# EAGLE design USB-DDC (EAGLE 9.6.2)
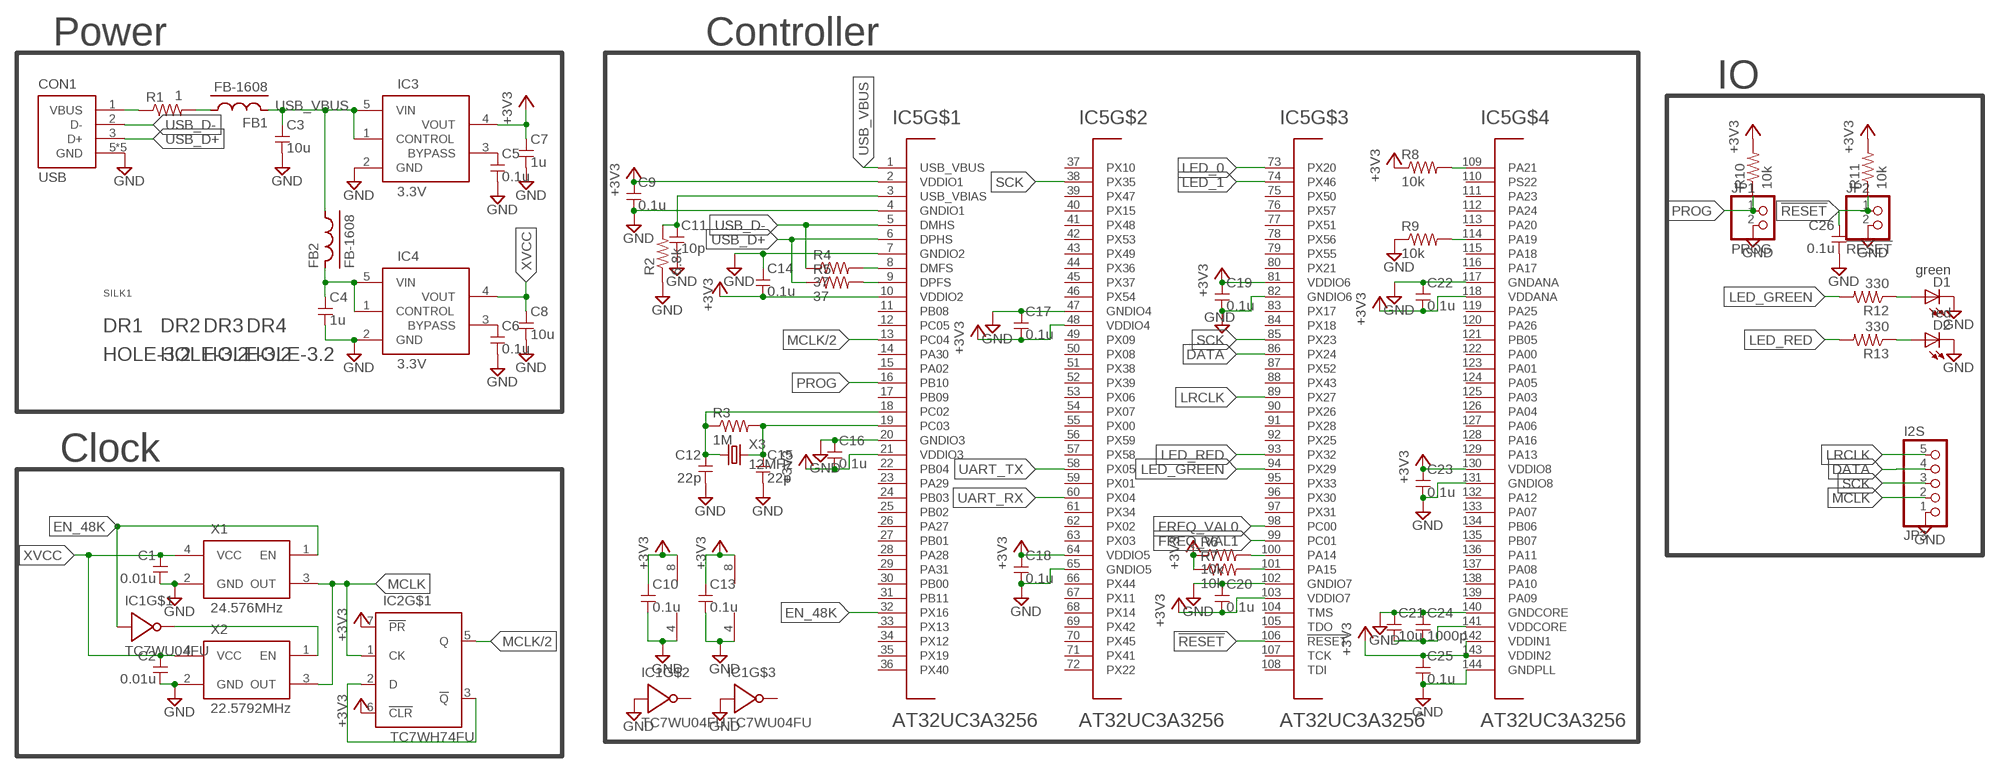
[diagram p0: schematic, sheet 1]

## Parts
C1  0.01u  C-1608  [1608]
C2  0.01u  C-1608  [1608]
C3  10u  C-2012  [2012]
C4  1u  C-1608  [1608]
C5  0.1u  C-1608  [1608]
C6  0.1u  C-1608  [1608]
C7  1u  C-2012  [2012]
C8  10u  C-2012  [2012]
C9  0.1u  C-1608  [1608]
C10  0.1u  C-1608  [1608]
C11  10p  C-1608  [1608]
C12  22p  C-1608  [1608]
C13  0.1u  C-1608  [1608]
C14  0.1u  C-1608  [1608]
C15  22p  C-1608  [1608]
C16  0.1u  C-1608  [1608]
C17  0.1u  C-1608  [1608]
C18  0.1u  C-1608  [1608]
C19  0.1u  C-1608  [1608]
C20  0.1u  C-1608  [1608]
C21  10u  C-2012  [2012]
C22  0.1u  C-1608  [1608]
C23  0.1u  C-1608  [1608]
C24  1000p  C-1608  [1608]
C25  0.1u  C-1608  [1608]
C26  0.1u  C-1608  [1608]
CON1  USB  [UX60A-MB-5ST]
D1  green  LED-SMD1608  [D1608]
D2  red  LED-SMD1608  [D1608]
DR1  HOLE-3.2  [HOLE_3.2]
DR2  HOLE-3.2  [HOLE_3.2]
DR3  HOLE-3.2  [HOLE_3.2]
DR4  HOLE-3.2  [HOLE_3.2]
FB1  FB-1608  [1608]
FB2  FB-1608  [1608]
IC1  TC7WU04FU  [SSOP8-P-0.65]
IC2  TC7WH74FU  [SSOP8-P-0.65]
IC3  3.3V  NJM2863  [SOT23-5]
IC4  3.3V  NJM2863  [SOT23-5]
IC5  AT32UC3A3256  [TQFP144]
JP1  PROG  PINHD-1X2  [1X02]
JP2  !RESET  PINHD-1X2  [1X02]
JP3  I2S  PINHD-1X5  [1X05]
R1  1  R-7.5  [0204/7]
R2  6.8k  R-1608  [1608]
R3  1M  R-7.5  [0204/7]
R4  37  R-1608  [1608]
R5  37  R-1608  [1608]
R6  10k  R-1608  [1608]
R7  10k  R-1608  [1608]
R8  10k  R-1608  [1608]
R9  10k  R-1608  [1608]
R10  10k  R-1608  [1608]
R11  10k  R-1608  [1608]
R12  330  R-1608  [1608]
R13  330  R-1608  [1608]
SILK1  ROBOTECHWHEELSILK-9MM  [ROBOTECHWHEEL-9MM]
X1  24.576MHz  OSC-KC7050  [KC7050]
X2  22.5792MHz  OSC-KC7050  [KC7050]
X3  12MHz  CRYSTALHC49S  [HC49/S]

## Nets
!RESET: C26.1 IC5.106(!RESET) JP2.1 R11.1
+3V3: C7.1 C9.1 C10.1 C13.1 C14.2 C16.2 C17.2 C18.1 C19.1 C20.2 C22.2 C23.1 C25.1 IC1.8(V+) IC2.6(!CLR) IC2.7(!PR) IC2.8(V+) IC3.4(VOUT) IC5.2(VDDIO1) IC5.10(VDDIO2) IC5.21(VDDIO3) IC5.48(VDDIO4) IC5.64(VDDIO5) IC5.81(VDDIO6) IC5.103(VDDIO7) IC5.118(VDDANA) IC5.130(VDDIO8) IC5.142(VDDIN1) IC5.143(VDDIN2) R6.1 R7.1 R8.1 R10.2 R11.2
DATA: IC5.86(PX24) JP3.4
EN_48K: IC1.1 IC5.32(PX16) X1.1(EN)
FREQ_VAL0: IC5.98(PC00)
FREQ_VAL1: IC5.99(PC01)
GND: C1.2 C2.2 C3.2 C4.2 C5.2 C6.2 C7.2 C8.2 C9.2 C10.2 C11.2 C12.2 C13.2 C14.1 C15.2 C16.1 C17.1 C18.2 C19.2 C20.1 C21.1 C22.1 C23.2 C24.1 C25.2 C26.2 CON1.5(GND) CON1.M1(GND) CON1.M2(GND) CON1.M3(GND) CON1.M4(GND) D1.K D2.K IC1.3 IC1.4(V-) IC1.6 IC2.4(V-) IC3.2(GND) IC4.2(GND) IC5.4(GNDIO1) IC5.7(GNDIO2) IC5.20(GNDIO3) IC5.47(GNDIO4) IC5.65(GNDIO5) IC5.82(GNDIO6) IC5.102(GNDIO7) IC5.117(GNDANA) IC5.131(GNDIO8) IC5.140(GNDCORE) IC5.144(GNDPLL) JP1.2 JP2.2 JP3.1 R2.1 R9.1 X1.2(GND) X2.2(GND)
LED_0: IC5.73(PX20)
LED_1: IC5.74(PX46)
LED_GREEN: IC5.94(PX29) R12.2
LED_RED: IC5.93(PX32) R13.2
LRCLK: IC5.89(PX27) JP3.5
MCLK: IC2.1(CK) JP3.2 X1.3(OUT) X2.3(OUT)
MCLK/2: IC2.5(Q) IC5.13(PC04)
N$1: C5.1 IC3.3(BYPASS)
N$2: C6.1 IC4.3(BYPASS)
N$3: FB1.1 R1.2
N$4: CON1.1(VBUS) R1.1
N$5: C4.1 FB2.2 IC4.1(CONTROL) IC4.5(VIN)
N$6: C11.1 IC5.3(USB_VBIAS) R2.2
N$7: IC5.8(DMFS) R4.2
N$8: IC5.9(DPFS) R5.2
N$9: D2.A R13.1
N$10: C15.1 IC5.19(PC03) R3.2 X3.2
N$11: C12.1 IC5.18(PC02) R3.1 X3.1
N$12: IC1.7 X2.1(EN)
N$13: IC5.100(PA14) R6.2
N$14: IC5.101(PA15) R7.2
N$15: D1.A R12.1
N$16: C21.2 C24.2 IC5.141(VDDCORE)
N$17: IC2.2(D) IC2.3(!Q)
N$18: IC5.109(PA21) R8.2
N$19: IC5.114(PA19) R9.2
PROG: IC5.16(PB10) JP1.1 R10.1
SCK: IC5.38(PX35) IC5.85(PX23) JP3.3
UART_RX: IC5.60(PX04)
UART_TX: IC5.58(PX05)
USB_D+: CON1.3(D+) IC5.6(DPHS) R5.1
USB_D-: CON1.2(D-) IC5.5(DMHS) R4.1
USB_VBUS: C3.1 FB1.2 FB2.1 IC3.1(CONTROL) IC3.5(VIN) IC5.1(USB_VBUS)
XVCC: C1.1 C2.1 C8.1 IC4.4(VOUT) X1.4(VCC) X2.4(VCC)
Unconnected: IC1.2 IC1.5 IC5.11(PB08) IC5.12(PC05) IC5.14(PA30) IC5.15(PA02) IC5.17(PB09) IC5.22(PB04) IC5.23(PA29) IC5.24(PB03) IC5.25(PB02) IC5.26(PA27) IC5.27(PB01) IC5.28(PA28) IC5.29(PA31) IC5.30(PB00) IC5.31(PB11) IC5.33(PX13) IC5.34(PX12) IC5.35(PX19) IC5.36(PX40) IC5.37(PX10) IC5.39(PX47) IC5.40(PX15) IC5.41(PX48) IC5.42(PX53) IC5.43(PX49) IC5.44(PX36) IC5.45(PX37) IC5.46(PX54) IC5.49(PX09) IC5.50(PX08) IC5.51(PX38) IC5.52(PX39) IC5.53(PX06) IC5.54(PX07) IC5.55(PX00) IC5.56(PX59) IC5.57(PX58) IC5.59(PX01) IC5.61(PX34) IC5.62(PX02) IC5.63(PX03) IC5.66(PX44) IC5.67(PX11) IC5.68(PX14) IC5.69(PX42) IC5.70(PX45) IC5.71(PX41) IC5.72(PX22) IC5.75(PX50) IC5.76(PX57) IC5.77(PX51) IC5.78(PX56) IC5.79(PX55) IC5.80(PX21) IC5.83(PX17) IC5.84(PX18) IC5.87(PX52) IC5.88(PX43) IC5.90(PX26) IC5.91(PX28) IC5.92(PX25) IC5.95(PX33) IC5.96(PX30) IC5.97(PX31) IC5.104(TMS) IC5.105(TDO) IC5.107(TCK) IC5.108(TDI) IC5.110(PS22) IC5.111(PA23) IC5.112(PA24) IC5.113(PA20) IC5.115(PA18) IC5.116(PA17) IC5.119(PA25) IC5.120(PA26) IC5.121(PB05) IC5.122(PA00) IC5.123(PA01) IC5.124(PA05) IC5.125(PA03) IC5.126(PA04) IC5.127(PA06) IC5.128(PA16) IC5.129(PA13) IC5.132(PA12) IC5.133(PA07) IC5.134(PB06) IC5.135(PB07) IC5.136(PA11) IC5.137(PA08) IC5.138(PA10) IC5.139(PA09)

## Notes on the sheet
- Power | Controller
- IO
- Clock

## Library data of the parts
C1-C26 = my_rcl:C
CON1 = my_connector:USB
D1 D2 = my_rcl:LED
DR1-DR4 = my_connector:HOLE-3.2
FB1 FB2 = my_rcl:FB
IC1 = my_ic:TC7WU04FU
IC2 = my_ic:TC7WH74FU
IC3 IC4 = my_ic:NJM2863
IC5 = my_ic:AT32UC3A3256
JP1 JP2 = pinhead:PINHD-1X2: PIN HEADER
JP3 = pinhead:PINHD-1X5: PIN HEADER
R1-R13 = my_rcl:R
SILK1 = Document_Robotech:ROBOTECHWHEEL
X1 X2 = my_rcl:OSC
X3 = my_rcl:CRYSTAL: CRYSTAL

## Board
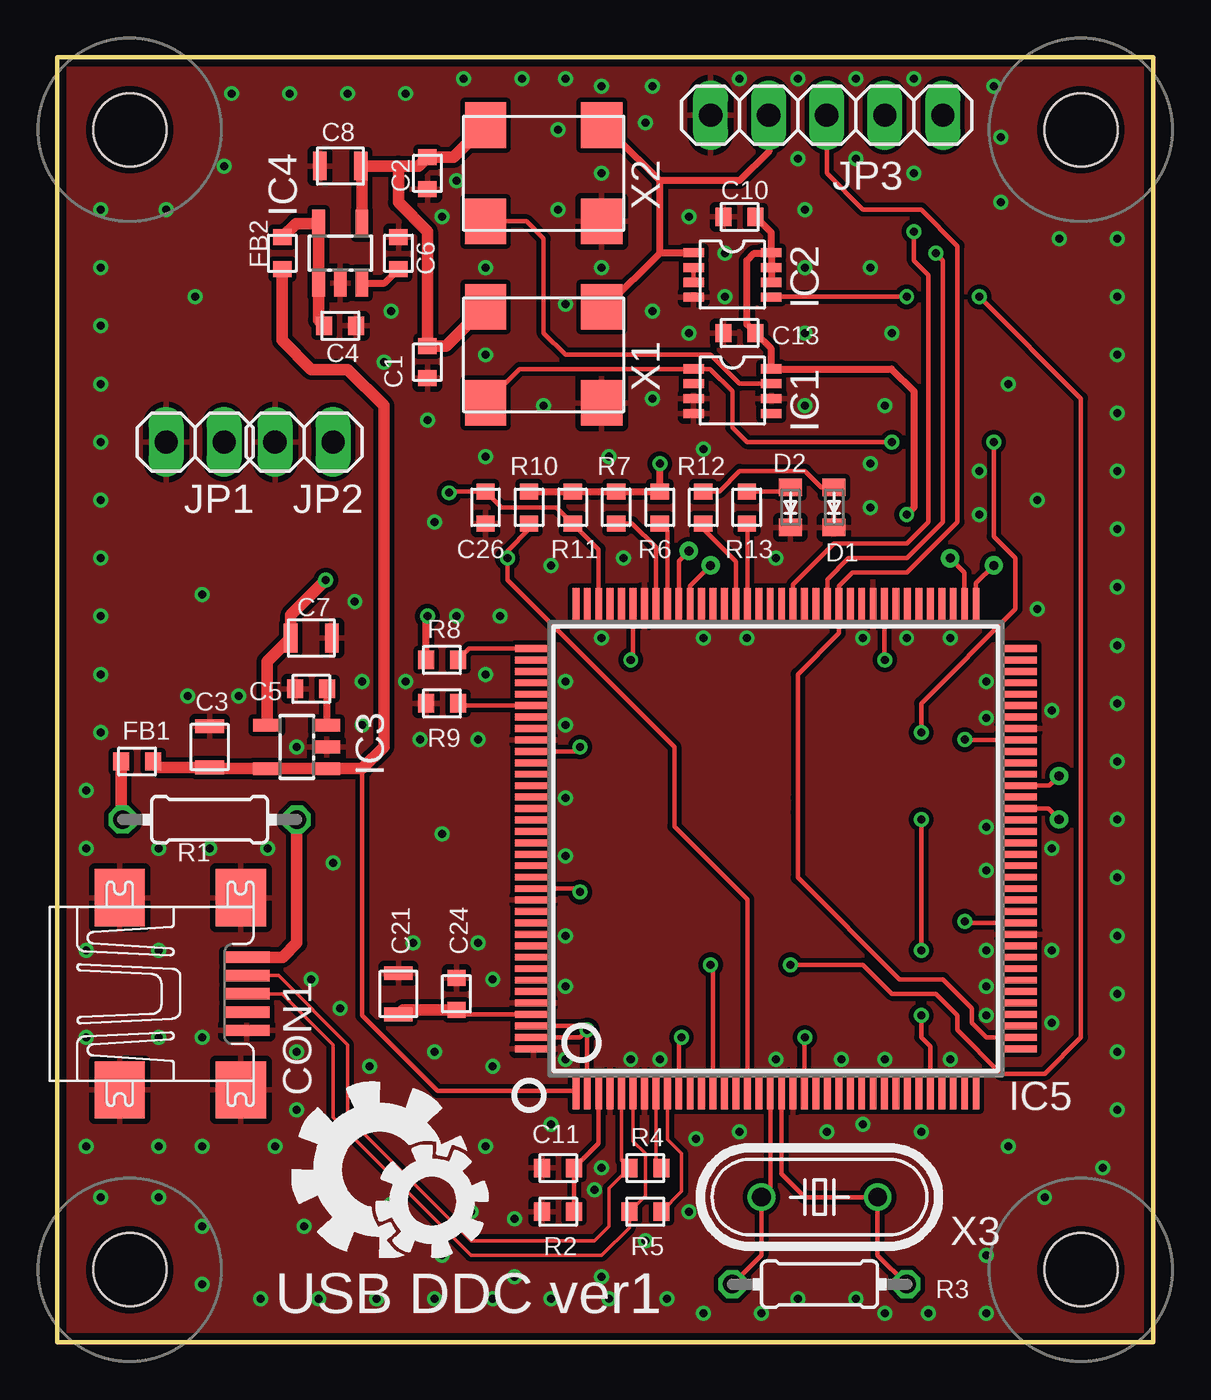
[diagram p1: board, top side]
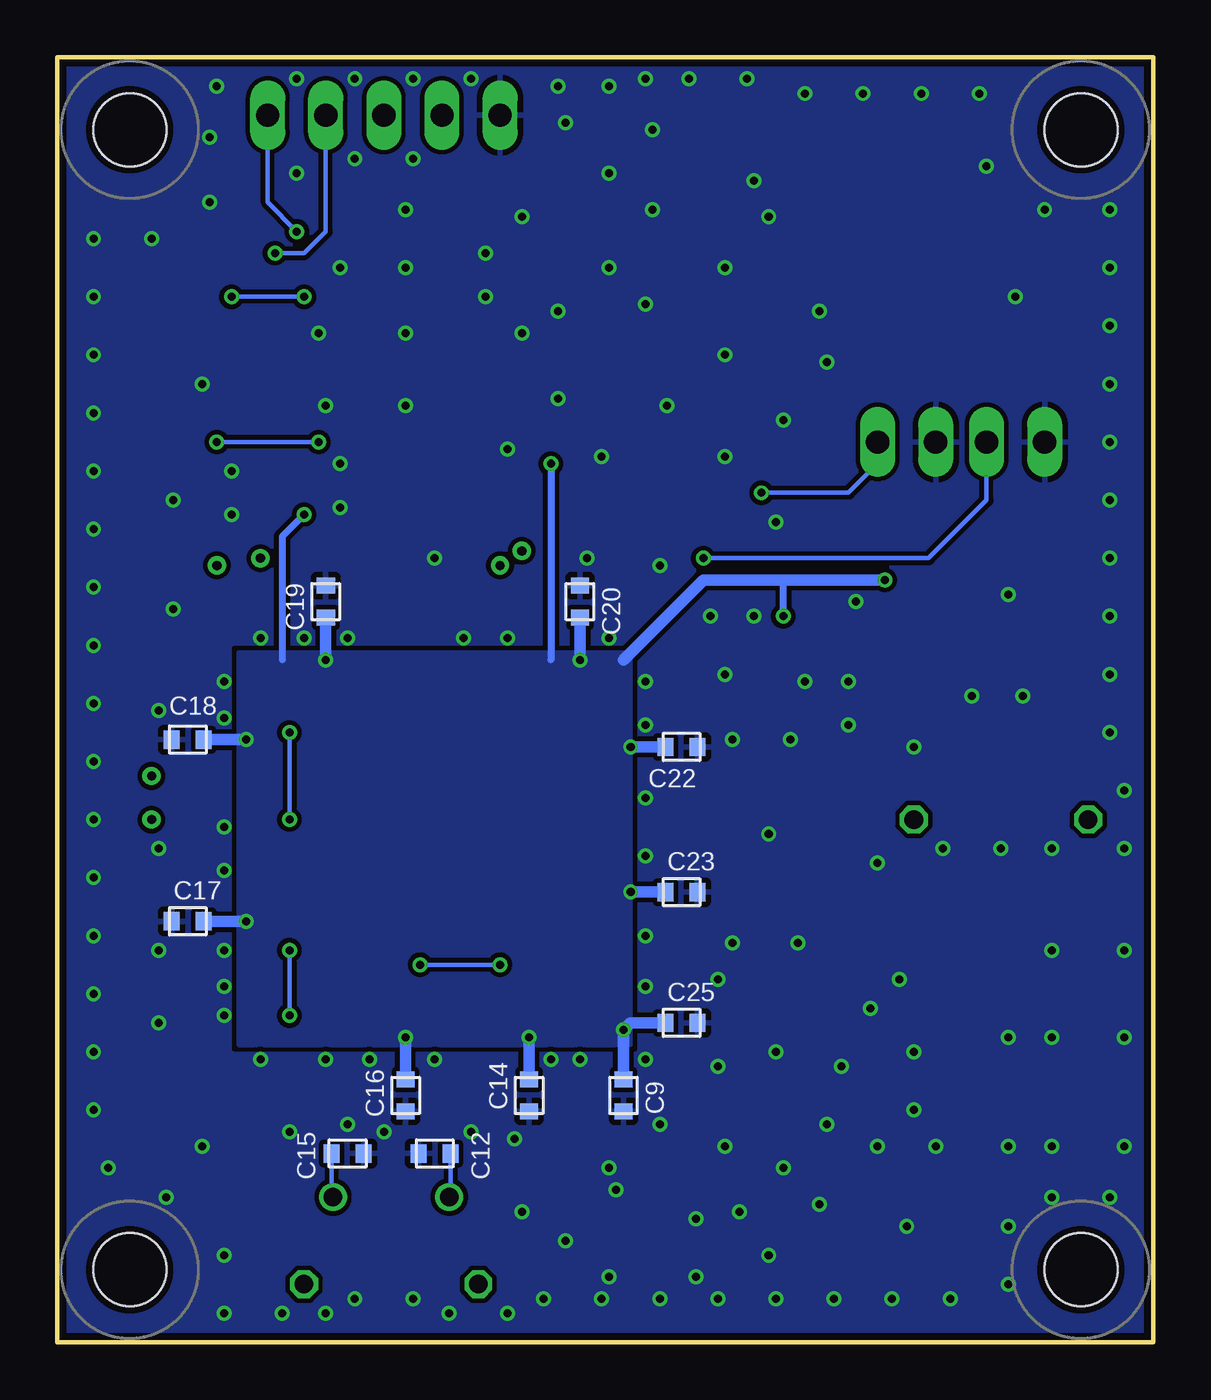
[diagram p2: board, bottom side, seen from below]

Size 47.94 x 56.2 mm. Coordinates in mm from the lower left corner, seen from the top.
Outline: 0,0 47.94,0 47.94,56.2 0,56.2 0,0
Copper layers (1*16): Top 0.035mm / dielectric 1.5mm / Bottom 0.035mm
Design rules "SeeedStudio_2layer_DRU_20140221 *": minimum track width 6mil, minimum drill 0.3mm, track to track 8mil, track to pad 8mil, pad to pad 6mil, via to via 12mil, smd to smd 0mil, copper to edge 0.3mm, drill to drill 10mil, minimum pad ring 0.15mm, minimum via ring 6mil, stop-mask expansion 2mil, vias tented up to drill 1mm, thermal gap 10mil

### Footprints (pad centres in the part's own frame; a part is rotated, then mirrored left to right if it is on the bottom)
1608 = smd 0.7 x 0.8: 1 -0.7,0; 2 0.7,0
2012 = smd 0.6 x 1.25: 1 -0.9,0; 2 0.9,0
UX60A-MB-5ST = smd 2 x 0.5: 1 2.25,1.6; 2 2.25,0.8; 3 2.25,0; 4 2.25,-0.8; 5 2.25,-1.6 | smd 2.2 x 2.5: M1 -3.3,-4.2; M2 -3.3,4.2; M3 2,4.2; M4 2,-4.2
D1608 = smd 0.762 x 1.016: A 0.875,0; K -0.875,0
HOLE_3.2 = hole 3.2: 0,0
SSOP8-P-0.65 = smd 0.4 x 0.9: 1 -0.975,-1.7; 2 -0.325,-1.7; 3 0.325,-1.7; 4 0.975,-1.7; 5 0.975,1.7; 6 0.325,1.7; 7 -0.325,1.7; 8 -0.975,1.7
SOT23-5 = smd 0.55 x 1.2: 1 -0.95,-1.3; 2 0,-1.3; 3 0.95,-1.3; 4 0.95,1.3; 5 -0.95,1.3
TQFP144 = smd 0.3 x 1.6: 1 -8.75,-10.6; 2 -8.25,-10.6; 3 -7.75,-10.6; 4 -7.25,-10.6; 5 -6.75,-10.6; 6 -6.25,-10.6; 7 -5.75,-10.6; 8 -5.25,-10.6; 9 -4.75,-10.6; 10 -4.25,-10.6; 11 -3.75,-10.6; 12 -3.25,-10.6; 13 -2.75,-10.6; 14 -2.25,-10.6; 15 -1.75,-10.6; 16 -1.25,-10.6; 17 -0.75,-10.6; 18 -0.25,-10.6; 19 0.25,-10.6; 20 0.75,-10.6; 21 1.25,-10.6; 22 1.75,-10.6; 23 2.25,-10.6; 24 2.75,-10.6; 25 3.25,-10.6; 26 3.75,-10.6; 27 4.25,-10.6; 28 4.75,-10.6; 29 5.25,-10.6; 30 5.75,-10.6; 31 6.25,-10.6; 32 6.75,-10.6; 33 7.25,-10.6; 34 7.75,-10.6; 35 8.25,-10.6; 36 8.75,-10.6; 73 8.75,10.6; 74 8.25,10.6; 75 7.75,10.6; 76 7.25,10.6; 77 6.75,10.6; 78 6.25,10.6; 79 5.75,10.6; 80 5.25,10.6; 81 4.75,10.6; 82 4.25,10.6; 83 3.75,10.6; 84 3.25,10.6; 85 2.75,10.6; 86 2.25,10.6; 87 1.75,10.6; 88 1.25,10.6; 89 0.75,10.6; 90 0.25,10.6; 91 -0.25,10.6; 92 -0.75,10.6; 93 -1.25,10.6; 94 -1.75,10.6; 95 -2.25,10.6; 96 -2.75,10.6; 97 -3.25,10.6; 98 -3.75,10.6; 99 -4.25,10.6; 100 -4.75,10.6; 101 -5.25,10.6; 102 -5.75,10.6; 103 -6.25,10.6; 104 -6.75,10.6; 105 -7.25,10.6; 106 -7.75,10.6; 107 -8.25,10.6; 108 -8.75,10.6 | smd 1.6 x 0.3: 37 10.6,-8.75; 38 10.6,-8.25; 39 10.6,-7.75; 40 10.6,-7.25; 41 10.6,-6.75; 42 10.6,-6.25; 43 10.6,-5.75; 44 10.6,-5.25; 45 10.6,-4.75; 46 10.6,-4.25; 47 10.6,-3.75; 48 10.6,-3.25; 49 10.6,-2.75; 50 10.6,-2.25; 51 10.6,-1.75; 52 10.6,-1.25; 53 10.6,-0.75; 54 10.6,-0.25; 55 10.6,0.25; 56 10.6,0.75; 57 10.6,1.25; 58 10.6,1.75; 59 10.6,2.25; 60 10.6,2.75; 61 10.6,3.25; 62 10.6,3.75; 63 10.6,4.25; 64 10.6,4.75; 65 10.6,5.25; 66 10.6,5.75; 67 10.6,6.25; 68 10.6,6.75; 69 10.6,7.25; 70 10.6,7.75; 71 10.6,8.25; 72 10.6,8.75; 109 -10.6,8.75; 110 -10.6,8.25; 111 -10.6,7.75; 112 -10.6,7.25; 113 -10.6,6.75; 114 -10.6,6.25; 115 -10.6,5.75; 116 -10.6,5.25; 117 -10.6,4.75; 118 -10.6,4.25; 119 -10.6,3.75; 120 -10.6,3.25; 121 -10.6,2.75; 122 -10.6,2.25; 123 -10.6,1.75; 124 -10.6,1.25; 125 -10.6,0.75; 126 -10.6,0.25; 127 -10.6,-0.25; 128 -10.6,-0.75; 129 -10.6,-1.25; 130 -10.6,-1.75; 131 -10.6,-2.25; 132 -10.6,-2.75; 133 -10.6,-3.25; 134 -10.6,-3.75; 135 -10.6,-4.25; 136 -10.6,-4.75; 137 -10.6,-5.25; 138 -10.6,-5.75; 139 -10.6,-6.25; 140 -10.6,-6.75; 141 -10.6,-7.25; 142 -10.6,-7.75; 143 -10.6,-8.25; 144 -10.6,-8.75
1X02 = drill 1.016 long: 1 -1.27,0; 2 1.27,0
1X05 = drill 1.016 long: 1 -5.08,0; 2 -2.54,0; 3 0,0; 4 2.54,0; 5 5.08,0
0204/7 = drill 0.813 octagon: 1 -3.81,0; 2 3.81,0
KC7050 = smd 1.8 x 2: 1 -2.54,-2.1; 2 2.54,-2.1; 3 2.54,2.1; 4 -2.54,2.1
HC49/S = drill 0.813: 1 -2.54,0; 2 2.54,0

### Placement (x,y rotation side)
C1  16.19,42.86 270 top
C2  16.19,51.12 270 top
C3  6.67,26.04 90 top
C4  12.38,44.45 0 top
C5  11.11,28.57 180 top
C6  14.92,47.62 90 top
C7  11.11,30.8 0 top
C8  12.38,51.44 180 top
C9  23.18,10.79 270 bottom
C10  29.84,49.21 180 top
C11  21.91,7.62 180 top
C12  31.43,8.26 180 bottom
C13  29.84,44.13 180 top
C14  27.3,10.79 90 bottom
C15  35.24,8.26 0 bottom
C16  32.7,10.79 90 bottom
C17  42.23,18.41 0 bottom
C18  42.23,26.35 180 bottom
C19  36.2,32.38 90 bottom
C20  25.08,32.38 270 bottom
C21  14.92,15.24 270 top
C22  20.64,26.04 180 bottom
C23  20.64,19.68 0 bottom
C24  17.46,15.24 270 top
C25  20.64,13.97 0 bottom
C26  18.73,36.51 270 top
CON1  6.03,15.24 0 top
D1  33.97,36.51 90 top
D2  32.07,36.51 90 top
DR1  3.17,3.17 0 top
DR2  44.77,3.17 0 top
DR3  3.17,53.02 0 top
DR4  44.77,53.02 0 top
FB1  3.49,25.4 0 top
FB2  9.84,47.62 90 top
IC1  29.53,41.59 270 top
IC2  29.53,46.67 270 top
IC3  10.48,26.04 90 top
IC4  12.38,47.62 0 top
IC5  31.43,21.59 0 top
JP1  6.03,39.37 180 top
JP2  10.79,39.37 180 top
JP3  33.66,53.66 0 top
R1  6.67,22.86 180 top
R2  21.91,5.71 0 top
R3  33.34,2.54 0 top
R4  25.72,7.62 0 top
R5  25.72,5.71 0 top
R6  26.35,36.51 270 top
R7  24.45,36.51 270 top
R8  16.83,29.84 0 top
R9  16.83,27.94 0 top
R10  20.64,36.51 90 top
R11  22.54,36.51 90 top
R12  28.26,36.51 270 top
R13  30.16,36.51 270 top
SILK1  10.16,3.49 0 top
X1  21.27,43.18 0 top
X2  21.27,51.12 0 top
X3  33.34,6.35 0 top

### Tracks (layer width: path | path; a pad name or v marks a point on that pad's centre or on a via)
!RESET  (via drill 0.35)
  Top 0.203: IC5.106 23.68,34.67 R11.1 21.84,36.51 19.43,36.51 C26.1 17.21,37.21 v17.14,37.15
  Bottom 0.203: v17.14,37.15 13.34,37.15 11.59,38.89 JP2.1
+3V3  (via drill 0.35)
  Top 0.203: IC5.103 25.18,29.84 v25.08,29.84 | IC5.118 22.66,25.84 v22.86,26.04 | IC5.130 22.7,19.84 v22.86,19.68 | IC5.10 27.18,13.21 v27.3,13.34 | IC5.21 32.68,13.31 v32.7,13.34 | IC5.48 39.76,18.34 v39.69,18.41 | IC5.64 v39.7,26.34 v39.69,26.35 | IC5.81 36.18,29.86 v36.2,29.84 | IC5.2 v23.18,13.65 | IC5.143 22.86,13.34 v23.18,13.65 | IC5.142 22.99,13.84 v23.18,13.65
  Top 0.305: C10.1 31.23,48.53 IC2.8 31.23,47.62 | R8.1 16.13,31.68 v16.19,31.75 | 31.23,47.62 IC2.7 IC2.6 | 31.23,47.62 30.48,47.62 30.16,47.31 30.16,44.52 C13.1 31.23,43.45 IC1.8 36.49,42.57 37.47,41.59 37.47,36.51 v37.15,36.2 | R10.2 R11.2 R7.1 R6.1 v26.35,38.42
  Top 0.508: IC3.4 9.18,29.76 C7.1 10.21,31.8 v11.75,33.34
  Bottom 0.305: v16.19,31.75 16.19,33.34 | v37.15,36.2 38.1,35.24 38.1,29.84 | v26.35,38.42 26.35,29.84
  Bottom 0.508: v11.75,33.34 16.19,33.34 19.68,33.34 23.18,29.84 | C22.2 v22.86,26.04 | C23.1 v22.86,19.68 | C14.2 v27.3,13.34 | C16.2 v32.7,13.34 | C17.2 v39.69,18.41 | C18.1 v39.69,26.35 | C19.1 v36.2,29.84 | C20.2 v25.08,29.84 | C9.1 v23.18,13.65 22.86,13.97 C25.1
  pour Bottom (isolate 0.203): 40.01,13.02 22.86,13.02 22.86,30.16 40.01,30.16
DATA  (via drill 0.35)
  Top 0.203: IC5.86 33.68,33.37 34.61,34.29 37.15,34.29 38.73,35.88 38.73,47.31 v38.42,47.62
  Bottom 0.203: v38.42,47.62 37.15,47.62 36.2,48.58 JP3.4
EN_48K  (via drill 0.35)
  Top 0.203: X1.1 20.22,42.57 IC1.1 28.55,42.57 29.53,41.59 29.53,40.01 30.16,39.37 v36.51,39.37 | v40.96,39.37 40.96,35.24 41.91,34.29 41.91,32.07 37.78,27.94 v37.78,26.67 | v37.78,22.86 v37.78,17.14 | v37.78,14.29 37.78,13.34 38.18,12.94 IC5.32
  Bottom 0.203: v36.51,39.37 v40.96,39.37 | v37.78,26.67 v37.78,22.86 | v37.78,17.14 v37.78,14.29
FREQ_VAL0  (via drill 0.4 pad 0.8)
  Top 0.203: IC5.98 27.68,33.08 v28.57,33.97
FREQ_VAL1  (via drill 0.4 pad 0.8)
  Top 0.203: IC5.99 27.18,34.17 v27.62,34.61
GND  (via drill 0.35)
  other vias: 24.77,34.29 22.23,26.99 23.81,30.8 28.26,30.8 35.24,30.8 37.15,30.8 39.05,30.8 40.64,27.3 40.64,28.89 40.64,22.54 40.64,20.64 40.64,17.14 40.64,15.56 40.64,14.29 39.05,12.38 34.29,12.38 36.2,12.38 31.43,12.38 26.35,12.38 25.08,12.38 22.23,12.38 22.23,15.56 22.23,17.78 22.23,21.27 22.23,23.81 22.23,28.89 30.16,30.8 27.62,49.21 29.21,47.62 29.21,45.72 27.62,44.13 26.04,45.09 32.7,44.13 36.51,44.13 36.2,40.96 32.7,40.96 28.26,39.05 26.04,41.27 24.13,38.73 21.27,40.96 18.73,38.73 16.19,40.32 14.29,42.86 14.61,45.09 17.46,50.8 16.83,49.21 21.91,49.53 23.81,51.12 23.81,46.99 22.23,45.4 21.91,53.02 23.81,54.93 25.72,53.34 18.73,43.18 18.73,46.99 21.59,33.97 19.37,31.75 17.46,31.75 16.51,35.88 13.34,26.99 13.34,28.89 13.02,32.38 10.48,26.04 7.94,28.26 5.71,28.26 1.27,21.59 4.45,21.59 6.67,21.59 9.21,21.59 1.27,17.14 1.27,13.34 4.45,13.34 1.27,8.57 4.45,8.57 6.35,8.57 6.35,13.34 9.53,8.57 10.48,12.7 10.48,10.16 4.45,17.14 11.11,15.88 12.38,14.61 13.65,12.06 14.29,9.53 16.19,7.62 18.1,5.71 20,5.4 23.5,6.67 23.81,7.62 12.06,8.57 14.61,6.03 16.83,3.81 20,2.86 23.81,2.86 25.72,4.45 27.62,5.71 29.84,9.21 27.94,8.89 33.66,9.21 35.24,9.53 37.78,9.21 43.5,17.14 43.5,13.97 43.5,21.59 43.5,27.62 42.86,32.07 42.86,36.83 41.59,41.91 31.43,34.29 35.56,36.51 35.56,38.42 35.56,46.99 32.7,46.99 32.7,49.53 40.32,38.1 40.32,36.2 12.06,20.95 15.56,17.46 19.05,15.88 18.41,17.46 18.41,26.35 16.83,22.23 18.73,29.21 15.24,28.89 15.88,26.35 1.91,49.53 1.91,46.99 1.91,44.45 1.91,41.91 1.91,39.37 1.91,36.83 1.91,34.29 1.91,31.75 1.91,29.21 1.91,26.67 1.27,24.13 1.91,6.35 4.45,6.35 6.35,5.08 6.35,2.54 8.89,1.91 11.43,1.91 13.97,1.91 16.51,1.91 19.05,1.91 21.59,1.91 24.13,1.91 26.67,1.91 28.26,1.27 30.8,1.27 32.38,1.91 34.92,1.91 36.2,1.27 38.1,1.27 40.64,1.27 40.64,3.81 43.18,6.35 45.72,7.62 46.35,10.16 46.35,12.7 46.35,15.24 46.35,17.78 46.35,20.32 46.35,22.86 46.35,25.4 46.35,27.94 46.35,30.48 46.35,33.02 46.35,35.56 46.35,38.1 46.35,40.64 46.35,43.18 46.35,45.72 46.35,48.26 43.81,48.26 41.27,49.85 41.27,52.7 7.62,54.61 10.16,54.61 12.7,54.61 15.24,54.61 17.78,55.24 20.32,55.24 22.23,55.24 26.04,54.93 37.47,55.24 34.92,55.24 32.38,55.24 29.84,55.24 40.96,54.93 32.38,51.75 34.92,51.75 37.47,51.12 4.76,49.53 7.3,51.44 6.03,45.72 6.35,32.7 10.79,5.08 41.59,8.57 21.59,9.53 18.73,8.57 16.51,12.7 19.05,12.06
  pour Bottom (isolate 0.203, rank 5): 0,56.2 0,0 47.94,0 47.94,56.2
  pour Top (isolate 0.203): 0,56.2 0,0 47.94,0 47.94,56.2
LED_0  (via drill 0.4 pad 0.8)
  Top 0.203: IC5.73 40.18,33.2 v40.96,33.97
LED_1  (via drill 0.4 pad 0.8)
  Top 0.203: IC5.74 39.68,33.66 v39.05,34.29
LED_GREEN
  Top 0.203: IC5.94 29.68,34.13 28.26,35.56 R12.2
LED_RED
  Top 0.203: IC5.93 30.18,35.79 R13.2
LRCLK  (via drill 0.35)
  Top 0.203: IC5.89 32.18,33.13 33.97,34.92 37.15,34.92 38.1,35.88 38.1,46.67 37.47,47.31 v37.47,48.58
  Bottom 0.203: v37.47,48.58 38.73,49.85 JP3.5
MCLK
  Top 0.305: JP3.2 31.11,52.07 29.84,50.8 26.35,50.8 | X2.3 24.13,53.22 24.13,52.7 24.45,52.7 26.35,50.8 | 26.35,47.62 26.35,50.8 | IC2.1 27.8,47.62 26.35,47.62 | X1.3 24.01,45.28 26.35,47.62
MCLK/2  (via drill 0.35)
  Top 0.203: IC5.13 28.68,16.4 v28.57,16.51 | v32.07,16.51 35.24,16.51 36.51,15.24 38.42,15.24 39.37,14.29 39.37,13.65 41.27,11.75 43.18,11.75 44.77,13.34 44.77,41.27 v40.32,45.72 | v37.15,45.72 31.25,45.72 IC2.5
  Bottom 0.203: v28.57,16.51 v32.07,16.51 | v37.15,45.72 v40.32,45.72
N$1
  Top 0.305: IC3.3 11.81,27.02 C5.1
N$2
  Top 0.305: IC4.3 14.32,46.33 C6.1
N$3
  Top 0.508: R1.2 2.79,22.93 FB1.1
N$4
  Top 0.508: CON1.1 9.86,16.84 10.48,17.46 R1.1
N$5
  Top 0.508: FB2.2 10.44,48.92 IC4.5 IC4.1 11.43,44.7 C4.1
N$6
  Top 0.203: IC5.3 23.68,8.7 C11.1 R2.2
N$7
  Top 0.152: R4.2 26.18,7.86 IC5.8
N$8
  Top 0.152: IC5.9 26.68,8.88 27.3,8.26 27.3,6.6 R5.2
N$9
  Top 0.203: R13.1 31.89,37.21 D2.A
N$10
  Top 0.203: IC5.19 31.68,7.37 32.7,6.35 X3.2 35.88,3.81 R3.2
  Bottom 0.203: C15.1 35.94,6.42 X3.2
N$11
  Top 0.203: IC5.18 31.18,6.74 X3.1 30.8,3.81 R3.1
  Bottom 0.203: C12.1 30.73,6.42 X3.1
N$12
  Top 0.203: IC1.7 29.84,41.92 28.57,43.18 22.23,43.18 21.27,44.13 21.27,48.26 20.52,49.02 X2.1
N$13
  Top 0.203: IC5.100 26.68,35.48 R6.2
N$14
  Top 0.203: IC5.101 26.18,34.78 25.15,35.81 R7.2
N$15
  Top 0.203: R12.1 28.96,37.21 29.84,38.1 32.7,38.1 33.41,37.39 D1.A
N$16
  Top 0.203: IC5.141 17.66,14.34 C24.2
  Top 0.508: C24.2 15.12,14.54 C21.2
N$17
  Top 0.203: IC2.2 IC2.3
N$18
  Top 0.203: IC5.109 18.02,30.34 R8.2
N$19
  Top 0.203: IC5.114 17.63,27.84 R9.2
PROG  (via drill 0.35)
  Top 0.203: R10.1 20.64,35.56 19.68,34.61 v19.68,34.29 19.68,33.34 26.99,26.04 26.99,22.56 30.18,19.37 IC5.16
  Bottom 0.203: v19.68,34.29 9.84,34.29 7.3,36.83 JP1.1
SCK
  Top 0.203: IC5.38 40.63,13.34 40.01,13.97 40.01,14.61 38.73,15.88 36.83,15.88 32.38,20.32 32.38,23.18 32.38,23.81 32.38,29.21 34.18,31.01 IC5.85 34.18,33.07 34.77,33.66 37.15,33.66 39.37,35.88 39.37,47.94 37.78,49.53 35.24,49.53 33.66,51.12 JP3.3
UART_RX  (via drill 0.4 pad 0.8)
  Top 0.203: IC5.60 43.39,24.34 v43.81,24.77
UART_TX  (via drill 0.4 pad 0.8)
  Top 0.203: IC5.58 43.34,23.34 v43.81,22.86
USB_D+
  Top 0.152: IC5.6 25.18,8.79 25.72,8.26 25.72,6.42 R5.1 25.02,5.01 23.81,3.81 18.1,3.81 12.06,9.84 12.06,13.02 9.84,15.24 CON1.3
USB_D-
  Top 0.152: IC5.5 24.68,7.96 R4.1 24.13,6.73 24.13,5.08 23.5,4.45 18.1,4.45 12.7,9.84 12.7,13.02 9.68,16.04 CON1.2
USB_VBUS
  Top 0.203: 13.34,25.09 13.34,22.23 13.34,14.29 16.63,10.99 IC5.1
  Top 0.508: FB1.2 4.46,25.14 C3.1 6.72,25.09 IC3.5 IC3.1 13.34,25.09 14.29,26.04 14.29,40.96 12.7,42.55 11.11,42.55 9.84,43.81 FB2.1
XVCC
  Top 0.508: IC4.4 13.33,51.38 C8.1 14.92,51.44 | 14.92,51.44 15.81,51.44 C2.1 17.33,51.82 X2.4 | 14.92,51.44 14.92,49.85 16.19,48.58 C1.1 17.02,43.56 X1.4

### Text on the board
tPlace: USB DDC ver1